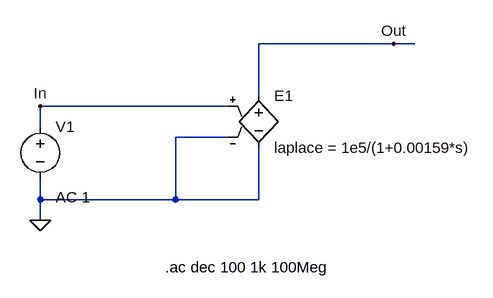
[diagram p0: schematic Draft3.asc]
Draft3.asc, the LTspice schematic file:
Version 4.1
SHEET 1 880 680
WIRE 624 -32 416 -32
WIRE 656 -32 624 -32
WIRE 416 48 416 -32
WIRE 368 64 80 64
WIRE 80 96 80 64
WIRE 368 112 288 112
WIRE 80 208 80 176
WIRE 288 208 288 112
WIRE 288 208 80 208
WIRE 416 208 416 128
WIRE 416 208 288 208
WIRE 80 240 80 208
FLAG 80 240 0
FLAG 624 -32 Out
FLAG 80 64 In
SYMBOL voltage 80 80 R0
WINDOW 123 24 124 Left 2
WINDOW 39 0 0 Left 0
SYMATTR InstName V1
SYMATTR Value ""
SYMATTR Value2 AC 1
SYMBOL e 416 32 R0
SYMATTR InstName E1
SYMATTR Value laplace = 1e5/(1+0.00159*s)
TEXT 272 312 Left 2 !.ac dec 100 1k 100Meg

The netlist it stands for:
* Draft3.asc
V1 In 0 AC 1
E1 Out 0 In 0 laplace = 1e5/(1+0.00159*s)
.ac dec 100 1k 100Meg
.backanno
.end